# EAGLE schematic MM Performer (EAGLE 9.6.2)
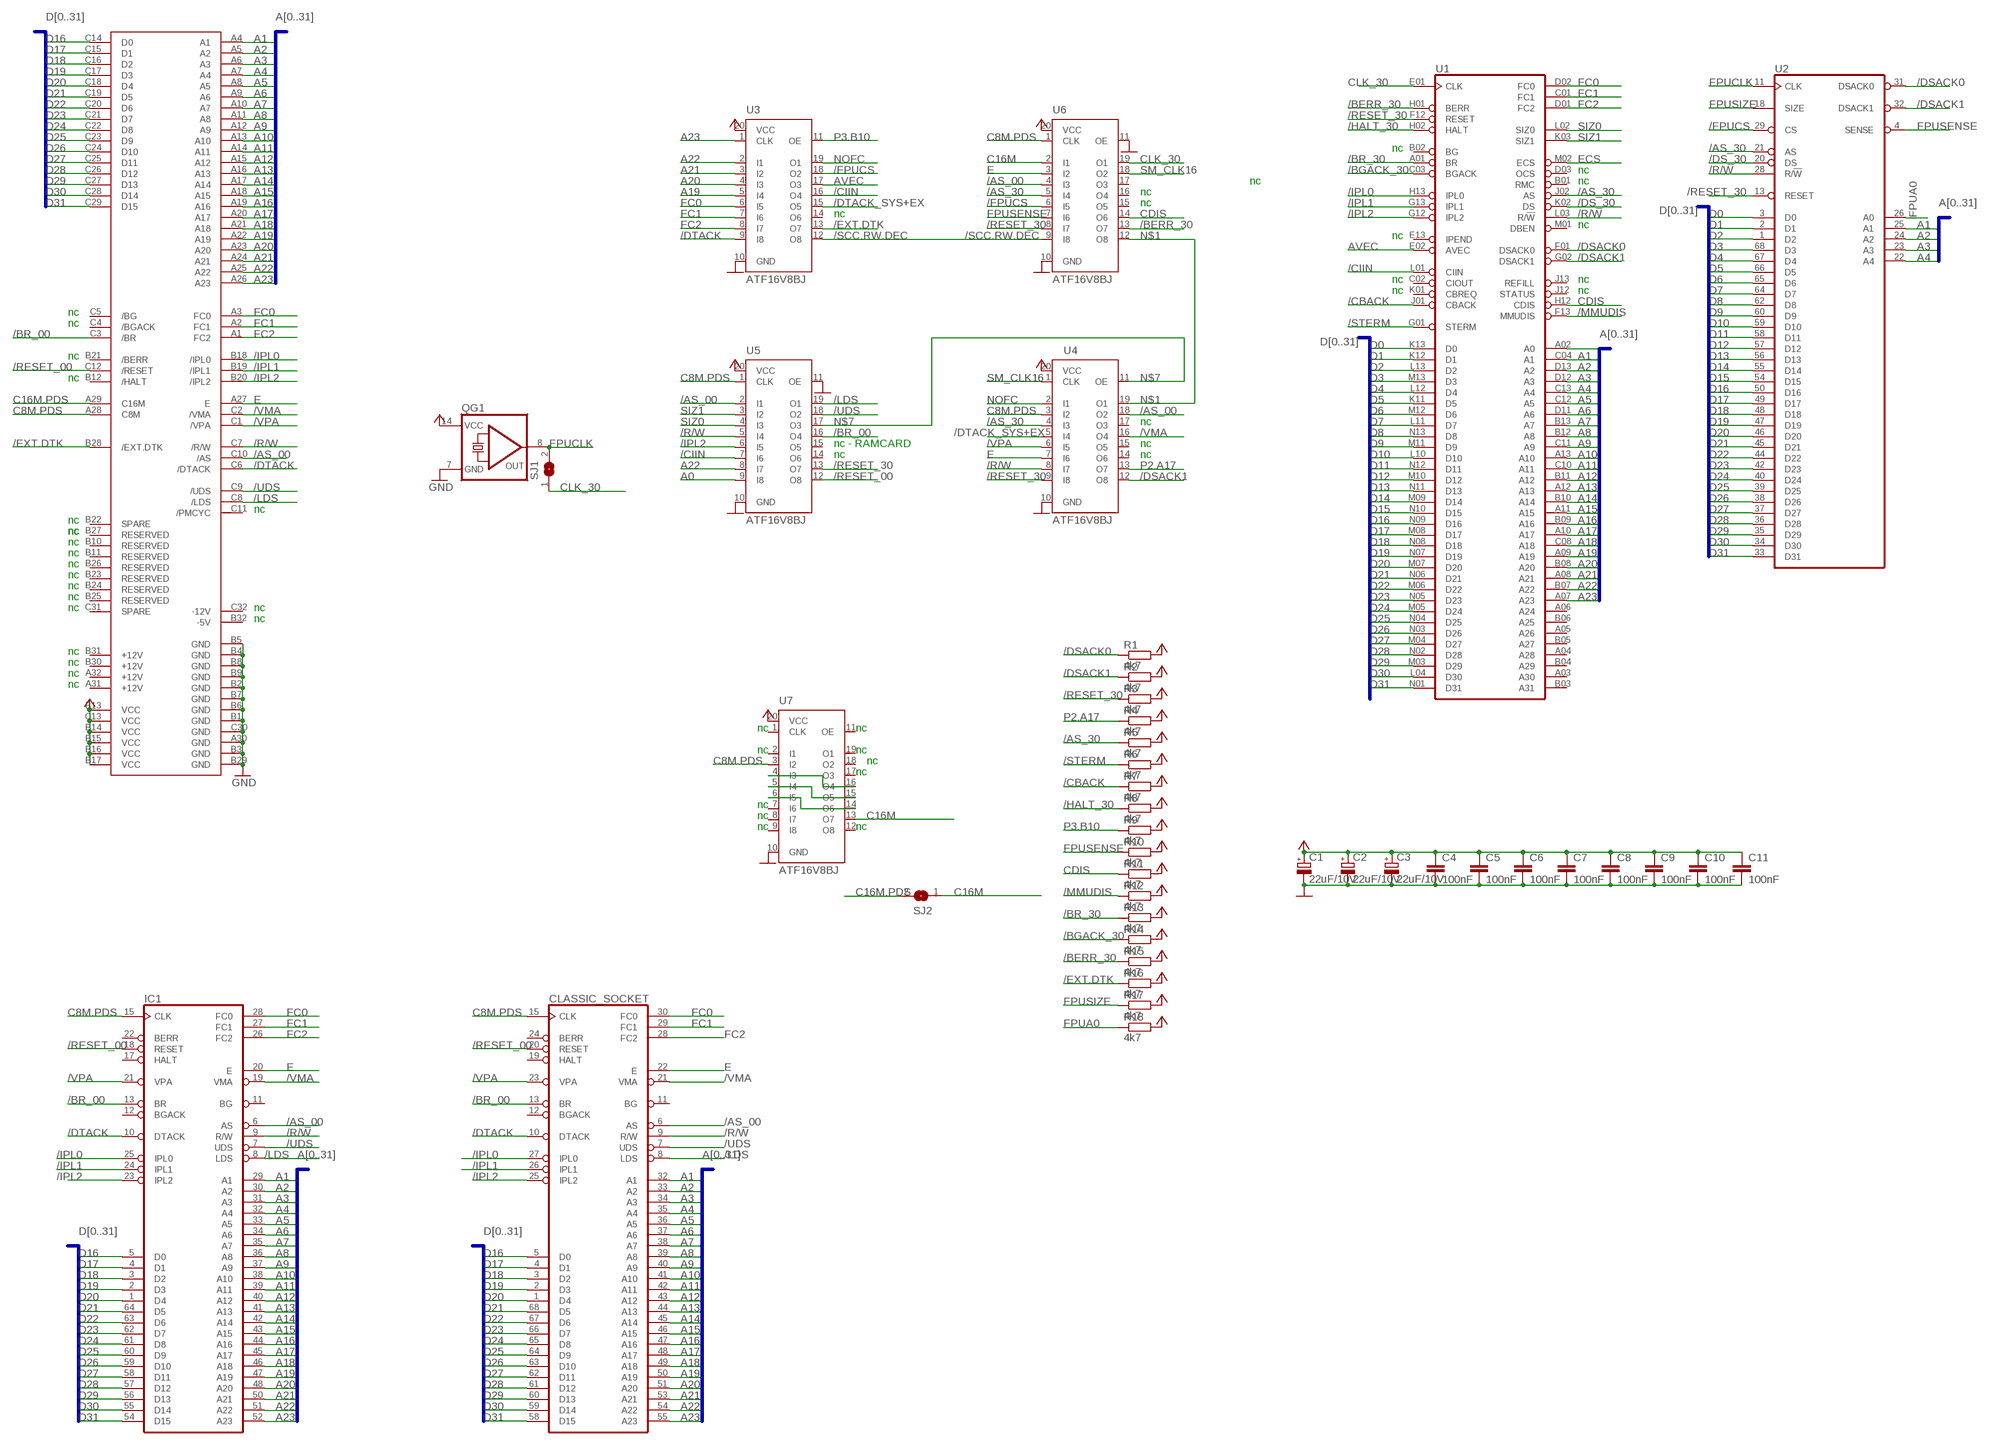
[diagram p0: schematic, sheet 1]

## Parts
C1  22uF/10V  CPOL-EUC/6032-28W  [C/6032-28W]
C2  22uF/10V  CPOL-EUC/6032-28W  [C/6032-28W]
C3  22uF/10V  CPOL-EUC/6032-28W  [C/6032-28W]
C4  100nF  C-EUC1206  [C1206]
C5  100nF  C-EUC1206  [C1206]
C6  100nF  C-EUC1206  [C1206]
C7  100nF  C-EUC1206  [C1206]
C8  100nF  C-EUC1206  [C1206]
C9  100nF  C-EUC1206  [C1206]
C10  100nF  C-EUC1206  [C1206]
C11  100nF  C-EUC1206  [C1206]
CLASSIC_SOCKET  MC68000FN-SOC  [PLCC68-S]
IC1  MC68000P  [DIL64]
QG1  QG5860  [DIL14S]
R1  4k7  R-EU_R1206  [R1206]
R2  4k7  R-EU_R1206  [R1206]
R3  4k7  R-EU_R1206  [R1206]
R4  4k7  R-EU_R1206  [R1206]
R5  4k7  R-EU_R1206  [R1206]
R6  4k7  R-EU_R1206  [R1206]
R7  4k7  R-EU_R1206  [R1206]
R8  4k7  R-EU_R1206  [R1206]
R9  4k7  R-EU_R1206  [R1206]
R10  4k7  R-EU_R1206  [R1206]
R11  4k7  R-EU_R1206  [R1206]
R12  4k7  R-EU_R1206  [R1206]
R13  4k7  R-EU_R1206  [R1206]
R14  4k7  R-EU_R1206  [R1206]
R15  4k7  R-EU_R1206  [R1206]
R16  4k7  R-EU_R1206  [R1206]
R17  4k7  R-EU_R1206  [R1206]
R18  4k7  R-EU_R1206  [R1206]
SJ1  SJ  [SJ]
SJ2  SJ  [SJ]
U1  MC68030RC  [MPGA128]
U2  MC68881FN-SOC  [PLCC68-S]
U3  ATF16V8BJ  [PLCC20]
U4  ATF16V8BJ  [PLCC20]
U5  ATF16V8BJ  [PLCC20]
U6  ATF16V8BJ  [PLCC20]
U7  ATF16V8BJ  [PLCC20]
U$1  MAC_SE_PDS  [MABC96_MIRROR]

## Nets
/AS_00: CLASSIC_SOCKET.6(AS) IC1.6(AS) U4.18(O2) U5.2(I1) U6.4(I3) U$1.C10(/AS)
/AS_30: R5.1 U1.J02(AS) U2.21(AS) U4.4(I3) U6.5(I4)
/BERR_30: R15.1 U1.H01(BERR) U6.13(O7)
/BGACK_30: R14.1 U1.C03(BGACK)
/BR_00: CLASSIC_SOCKET.13(BR) IC1.13(BR) U5.16(O4) U$1.C3(/BR)
/BR_30: R13.1 U1.A01(BR)
/CBACK: R7.1 U1.J01(CBACK)
/CIIN: U1.L01(CIIN) U3.16(O4) U5.7(I6)
/DS_30: U1.K02(DS) U2.20(DS)
/DSACK0: R1.1 U1.F01(DSACK0) U2.31(DSACK0)
/DSACK1: R2.1 U1.G02(DSACK1) U2.32(DSACK1) U4.12(O8)
/DTACK: CLASSIC_SOCKET.10(DTACK) IC1.10(DTACK) U3.9(I8) U$1.C6(/DTACK)
/DTACK_SYS+EX: U3.15(O5) U4.5(I4)
/EXT.DTK: R16.1 U3.13(O7) U$1.B28(/EXT.DTK)
/FPUCS: U2.29(CS) U3.18(O2) U6.6(I5)
/HALT_30: R8.1 U1.H02(HALT)
/IPL0: CLASSIC_SOCKET.27(IPL0) IC1.25(IPL0) U1.H13(IPL0) U$1.B18(/IPL0)
/IPL1: CLASSIC_SOCKET.26(IPL1) IC1.24(IPL1) U1.G13(IPL1) U$1.B19(/IPL1)
/IPL2: CLASSIC_SOCKET.25(IPL2) IC1.23(IPL2) U1.G12(IPL2) U5.6(I5) U$1.B20(/IPL2)
/LDS: CLASSIC_SOCKET.8(LDS) IC1.8(LDS) U5.19(O1) U$1.C8(/LDS)
/MMUDIS: R12.1 U1.F13(MMUDIS)
/R/W: CLASSIC_SOCKET.9(R/W) IC1.9(R/W) U1.L03(R/!W) U2.28(R/!W) U4.8(I7) U5.5(I4) U$1.C7(/R/W)
/RESET_00: CLASSIC_SOCKET.20(RESET) IC1.18(RESET) U5.12(O8) U$1.C12(/RESET)
/RESET_30: R3.1 U1.F12(RESET) U2.13(RESET) U4.9(I8) U5.13(O7) U6.8(I7)
/SCC.RW.DEC: U3.12(O8) U6.9(I8)
/STERM: R6.1 U1.G01(STERM)
/UDS: CLASSIC_SOCKET.7(UDS) IC1.7(UDS) U5.18(O2) U$1.C9(/UDS)
/VMA: CLASSIC_SOCKET.21(VMA) IC1.19(VMA) U4.16(O4) U$1.C2(/VMA)
/VPA: CLASSIC_SOCKET.23(VPA) IC1.21(VPA) U4.6(I5) U$1.C1(/VPA)
A0: U1.A02(A0) U5.9(I8)
A1: CLASSIC_SOCKET.32(A1) IC1.29(A1) U1.C04(A1) U2.25(A1) U$1.A4(A1)
A2: CLASSIC_SOCKET.33(A2) IC1.30(A2) U1.D13(A2) U2.24(A2) U$1.A5(A2)
A3: CLASSIC_SOCKET.34(A3) IC1.31(A3) U1.D12(A3) U2.23(A3) U$1.A6(A3)
A4: CLASSIC_SOCKET.35(A4) IC1.32(A4) U1.C13(A4) U2.22(A4) U$1.A7(A4)
A5: CLASSIC_SOCKET.36(A5) IC1.33(A5) U1.C12(A5) U$1.A8(A5)
A6: CLASSIC_SOCKET.37(A6) IC1.34(A6) U1.D11(A6) U$1.A9(A6)
A7: CLASSIC_SOCKET.38(A7) IC1.35(A7) U1.B13(A7) U$1.A10(A7)
A8: CLASSIC_SOCKET.39(A8) IC1.36(A8) U1.B12(A8) U$1.A11(A8)
A9: CLASSIC_SOCKET.40(A9) IC1.37(A9) U1.C11(A9) U$1.A12(A9)
A10: CLASSIC_SOCKET.41(A10) IC1.38(A10) U1.A13(A10) U$1.A13(A10)
A11: CLASSIC_SOCKET.42(A11) IC1.39(A11) U1.C10(A11) U$1.A14(A11)
A12: CLASSIC_SOCKET.43(A12) IC1.40(A12) U1.B11(A12) U$1.A15(A12)
A13: CLASSIC_SOCKET.44(A13) IC1.41(A13) U1.A12(A13) U$1.A16(A13)
A14: CLASSIC_SOCKET.45(A14) IC1.42(A14) U1.B10(A14) U$1.A17(A14)
A15: CLASSIC_SOCKET.46(A15) IC1.43(A15) U1.A11(A15) U$1.A18(A15)
A16: CLASSIC_SOCKET.47(A16) IC1.44(A16) U1.B09(A16) U$1.A19(A16)
A17: CLASSIC_SOCKET.48(A17) IC1.45(A17) U1.A10(A17) U$1.A20(A17)
A18: CLASSIC_SOCKET.49(A18) IC1.46(A18) U1.C08(A18) U$1.A21(A18)
A19: CLASSIC_SOCKET.50(A19) IC1.47(A19) U1.A09(A19) U3.5(I4) U$1.A22(A19)
A20: CLASSIC_SOCKET.51(A20) IC1.48(A20) U1.B08(A20) U3.4(I3) U$1.A23(A20)
A21: CLASSIC_SOCKET.53(A21) IC1.50(A21) U1.A08(A21) U3.3(I2) U$1.A24(A21)
A22: CLASSIC_SOCKET.54(A22) IC1.51(A22) U1.B07(A22) U3.2(I1) U5.8(I7) U$1.A25(A22)
A23: CLASSIC_SOCKET.55(A23) IC1.52(A23) U1.A07(A23) U3.1(CLK) U$1.A26(A23)
AVEC: U1.E02(AVEC) U3.17(O3)
C8M.PDS: CLASSIC_SOCKET.15(CLK) IC1.15(CLK) U4.3(I2) U5.1(CLK) U6.1(CLK) U7.3(I2) U$1.A28(C8M)
C16M: SJ2.1 U6.2(I1) U7.13(O7)
C16M.PDS: SJ2.2 U$1.A29(C16M)
CDIS: R11.1 U1.H12(CDIS) U6.14(O6)
CLK_30: SJ1.1 U1.E01(CLK) U6.19(O1)
D0: U1.K13(D0) U2.3(D0)
D1: U1.K12(D1) U2.2(D1)
D2: U1.L13(D2) U2.1(D2)
D3: U1.M13(D3) U2.68(D3)
D4: U1.L12(D4) U2.67(D4)
D5: U1.K11(D5) U2.66(D5)
D6: U1.M12(D6) U2.65(D6)
D7: U1.L11(D7) U2.64(D7)
D8: U1.N13(D8) U2.62(D8)
D9: U1.M11(D9) U2.60(D9)
D10: U1.L10(D10) U2.59(D10)
D11: U1.N12(D11) U2.58(D11)
D12: U1.M10(D12) U2.57(D12)
D13: U1.N11(D13) U2.56(D13)
D14: U1.M09(D14) U2.55(D14)
D15: U1.N10(D15) U2.54(D15)
D16: CLASSIC_SOCKET.5(D0) IC1.5(D0) U1.N09(D16) U2.50(D16) U$1.C14(D0)
D17: CLASSIC_SOCKET.4(D1) IC1.4(D1) U1.M08(D17) U2.49(D17) U$1.C15(D1)
D18: CLASSIC_SOCKET.3(D2) IC1.3(D2) U1.N08(D18) U2.48(D18) U$1.C16(D2)
D19: CLASSIC_SOCKET.2(D3) IC1.2(D3) U1.N07(D19) U2.47(D19) U$1.C17(D3)
D20: CLASSIC_SOCKET.1(D4) IC1.1(D4) U1.M07(D20) U2.46(D20) U$1.C18(D4)
D21: CLASSIC_SOCKET.68(D5) IC1.64(D5) U1.N06(D21) U2.45(D21) U$1.C19(D5)
D22: CLASSIC_SOCKET.67(D6) IC1.63(D6) U1.M06(D22) U2.44(D22) U$1.C20(D6)
D23: CLASSIC_SOCKET.66(D7) IC1.62(D7) U1.N05(D23) U2.42(D23) U$1.C21(D7)
D24: CLASSIC_SOCKET.65(D8) IC1.61(D8) U1.M05(D24) U2.40(D24) U$1.C22(D8)
D25: CLASSIC_SOCKET.64(D9) IC1.60(D9) U1.N04(D25) U2.39(D25) U$1.C23(D9)
D26: CLASSIC_SOCKET.63(D10) IC1.59(D10) U1.N03(D26) U2.38(D26) U$1.C24(D10)
D27: CLASSIC_SOCKET.62(D11) IC1.58(D11) U1.M04(D27) U2.37(D27) U$1.C25(D11)
D28: CLASSIC_SOCKET.61(D12) IC1.57(D12) U1.N02(D28) U2.36(D28) U$1.C26(D12)
D29: CLASSIC_SOCKET.60(D13) IC1.56(D13) U1.M03(D29) U2.35(D29) U$1.C27(D13)
D30: CLASSIC_SOCKET.59(D14) IC1.55(D14) U1.L04(D30) U2.34(D30) U$1.C28(D14)
D31: CLASSIC_SOCKET.58(D15) IC1.54(D15) U1.N01(D31) U2.33(D31) U$1.C29(D15)
E: CLASSIC_SOCKET.22(E) IC1.20(E) U4.7(I6) U6.3(I2) U$1.A27(E)
ECS: U1.M02(ECS)
FC0: CLASSIC_SOCKET.30(FC0) IC1.28(FC0) U1.D02(FC0) U3.6(I5) U$1.A3(FC0)
FC1: CLASSIC_SOCKET.29(FC1) IC1.27(FC1) U1.C01(FC1) U3.7(I6) U$1.A2(FC1)
FC2: CLASSIC_SOCKET.28(FC2) IC1.26(FC2) U1.D01(FC2) U3.8(I7) U$1.A1(FC2)
FPUA0: R18.1 U2.26(A0)
FPUCLK: QG1.8(OUT) SJ1.2 U2.11(CLK)
FPUSENSE: R10.1 U2.4(SENSE) U6.7(I6)
FPUSIZE: R17.1 U2.18(SIZE)
GND: C1.- C2.- C3.- C4.2 C5.2 C6.2 C7.2 C8.2 C9.2 C10.2 C11.2 QG1.7(GND) U3.10(GND) U4.10(GND) U5.10(GND) U5.11(OE) U6.10(GND) U6.11(OE) U7.10(GND) U$1.A30(GND) U$1.B1(GND) U$1.B2(GND) U$1.B3(GND) U$1.B4(GND) U$1.B5(GND) U$1.B6(GND) U$1.B7(GND) U$1.B8(GND) U$1.B9(GND) U$1.B29(GND) U$1.C30(GND)
N$1: U4.19(O1) U6.12(O8)
N$2: U7.4(I3) U7.16(O4)
N$3: U7.5(I4) U7.15(O5)
N$4: U7.6(I5) U7.14(O6)
N$7: U4.11(OE) U5.17(O3)
NOFC: U3.19(O1) U4.2(I1)
P2.A17: R4.1 U4.13(O7)
P3.B10: R9.1 U3.11(OE)
SIZ0: U1.L02(SIZ0) U5.4(I3)
SIZ1: U1.K03(SIZ1) U5.3(I2)
SM_CLK16: U4.1(CLK) U6.18(O2)
VCC: C1.+ C2.+ C3.+ C4.1 C5.1 C6.1 C7.1 C8.1 C9.1 C10.1 C11.1 QG1.14(VCC) R1.2 R2.2 R3.2 R4.2 R5.2 R6.2 R7.2 R8.2 R9.2 R10.2 R11.2 R12.2 R13.2 R14.2 R15.2 R16.2 R17.2 R18.2 U3.20(VCC) U4.20(VCC) U5.20(VCC) U6.20(VCC) U7.20(VCC) U$1.B13(VCC) U$1.B14(VCC) U$1.B15(VCC) U$1.B16(VCC) U$1.B17(VCC) U$1.C13(VCC)
Unconnected: CLASSIC_SOCKET.11(BG) CLASSIC_SOCKET.12(BGACK) CLASSIC_SOCKET.19(HALT) CLASSIC_SOCKET.24(BERR) IC1.11(BG) IC1.12(BGACK) IC1.17(HALT) IC1.22(BERR) U1.A03(A30) U1.A04(A28) U1.A05(A26) U1.A06(A24) U1.B01(RMC) U1.B02(BG) U1.B03(A31) U1.B04(A29) U1.B05(A27) U1.B06(A25) U1.C02(CIOUT) U1.D03(OCS) U1.E13(IPEND) U1.J12(STATUS) U1.J13(REFILL) U1.K01(CBREQ) U1.M01(DBEN) U3.14(O6) U4.14(O6) U4.15(O5) U4.17(O3) U5.14(O6) U5.15(O5) U6.15(O5) U6.16(O4) U6.17(O3) U7.1(CLK) U7.2(I1) U7.7(I6) U7.8(I7) U7.9(I8) U7.11(OE) U7.12(O8) U7.17(O3) U7.18(O2) U7.19(O1) U$1.A31(+12V) U$1.A32(+12V) U$1.B10(RESERVED) U$1.B11(RESERVED) U$1.B12(/HALT) U$1.B21(/BERR) U$1.B22(SPARE) U$1.B23(RESERVED) U$1.B24(RESERVED) U$1.B25(RESERVED) U$1.B26(RESERVED) U$1.B27(RESERVED) U$1.B30(+12V) U$1.B31(+12V) U$1.B32(-5V) U$1.C4(/BGACK) U$1.C5(/BG) U$1.C11(/PMCYC) U$1.C31(SPARE) U$1.C32(-12V)

## Buses
A[0..31]
D[0..31]

## Notes on the sheet
- nc
- nc
- nc | nc
- nc
- nc
- nc
- nc
- nc
- nc | nc
- nc | nc
- nc
- nc
- nc
- nc
- nc
- nc - RAMCARD | nc
- nc | nc
- nc
- nc
- nc | nc
- nc
- nc
- nc
- nc
- nc
- nc
- nc | nc
- nc
- nc
- nc
- nc
- nc
- nc | nc
- nc | nc
- nc
- nc
- nc
- nc
- nc | nc

## Power pins joined to a net without a drawn wire
GND: CLASSIC_SOCKET.16(GND) CLASSIC_SOCKET.17(GND) CLASSIC_SOCKET.56(GND) CLASSIC_SOCKET.57(GND) IC1.16(GND) IC1.53(GND) U1.C05(GND) U1.C07(GND) U1.C09(GND) U1.E03(GND) U1.E11(GND) U1.F03(GND) U1.G03(GND) U1.G11(GND) U1.J03(GND) U1.J11(GND) U1.L05(GND) U1.L07(GND) U1.L08(GND) U1.L09(GND) U2.5(GND) U2.6(GND) U2.7(GND) U2.8(GND) U2.9(GND) U2.12(GND) U2.14(GND) U2.19(GND) U2.30(GND) U2.41(GND) U2.51(GND) U2.63(GND)
VCC: CLASSIC_SOCKET.14(VCC) CLASSIC_SOCKET.52(VCC) IC1.14(VCC) IC1.49(VCC) U1.C06(VCC) U1.D04(VCC) U1.D10(VCC) U1.F02(VCC) U1.F11(VCC) U1.H03(VCC) U1.H11(VCC) U1.K04(VCC) U1.K10(VCC) U1.L06(VCC) U2.10(VCC) U2.16(VCC) U2.17(VCC) U2.27(VCC) U2.43(VCC) U2.52(VCC) U2.53(VCC) U2.61(VCC)

## Library data of the parts
C1-C3 = rcl:CPOL-EU: POLARIZED CAPACITOR, European symbol; SPICEPREFIX: C
C4-C11 = rcl:C-EU: CAPACITOR, European symbol; SPICEPREFIX: C
CLASSIC_SOCKET = micro-mc68000:MC68000FN: 68xxx PROCESSOR; OC_FARNELL: unknown; OC_NEWARK: unknown
IC1 = micro-mc68000:MC68000P: 68xxx PROCESSOR; OC_FARNELL: unknown; OC_NEWARK: unknown
QG1 = crystal:QG5860: CRYSTAL RESONATOR; OC_FARNELL: unknown; OC_NEWARK: unknown
R1-R18 = rcl:R-EU_: RESISTOR, European symbol; SPICEPREFIX: R
SJ1 SJ2 = jumper:SJ: SMD solder JUMPER
U1 = micro-mc68000:MC68030RC: 68xxx PROCESSOR; MF: MOTOROLA; MPN: MC68030RC50C; OC_FARNELL: unknown; OC_NEWARK: 52F3269
U2 = micro-mc68000:MC68881FN: 68xxx PROCESSOR; OC_FARNELL: unknown; OC_NEWARK: unknown
U3-U7 = atmel:ATF16V8B: High perfomance CMOS (electrically erasable) programmable logic device (PLD) ABLE-Atmel-ABEL - P18V8R, P16V8C, P16V8AS, P17V8 COPL Atmel-WinCUPL - G16V8MS, G16V8MA, G16V8AS, G16V8 LOG/IC - GAL16V8_R, GAL16V8_G7, GAL16V8_C), GAL16V8 Tango-PLD - G16V8R, G16V8C, G16V8AS, G16V8 Source: http://www.atmel.com/dyn/resources/prod_documents/DOC0364.PDF; MPN: ATF16V8CZ-15JU; OC_FARNELL: 1551767; OC_NEWARK: 94M6253
U$1 = Eigene Sachen:MAC_SE_PDS